# Altium project Capstone_Mainboard.PrjPcb (part 2 of 2)
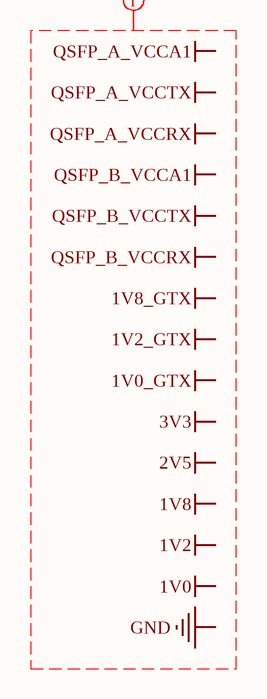
[diagram p11: Misc_Functions.SchDoc]

## Nets that join several sheets
1V2_GTX: FPGA_Power (8 pins), FPGA_GTXqs (R?#5.2)
1V8: HPCC_Connector_A (6 pins), HPCC_Connector_B (6 pins), FPGA_Power (31 pins), FPGA_HPCC_A_BG33-34-35 (R?#3.1)
3V3: FPGA_FLASH (7 pins), I2C_Switch_I2C_EEPROM (23 pins), QSFP_Cages_Connectors (16 pins), HPCC_Connector_A (12 pins), HPCC_Connector_B (12 pins), FPGA_Power (18 pins), FPGA_Configuration_JTAG (5 pins), FPGA_GTXqs (C37.2 U4.1 U4.6)
3V3AUX: HPCC_Connector_A (J3.A11), HPCC_Connector_B (J4.A11)
GND: FPGA_FLASH (A1.4 C1.1), I2C_Switch_I2C_EEPROM (9 pins), QSFP_Cages_Connectors (64 pins), HPCC_Connector_A (209 pins), HPCC_Connector_B (209 pins), FPGA_Power (139 pins), FPGA_Configuration_JTAG (8 pins), FPGA_HPCC_B_BG13-15-16 (6 pins), FPGA_HPCC_A_BG33-34-35 (5 pins), FPGA_GTXqs (C37.1 U4.3)
FGPA_I2C_SCL: I2C_Switch_I2C_EEPROM (R9.1 U1.19), FPGA_Configuration_JTAG (U3.A24)
FGPA_I2C_SDA: I2C_Switch_I2C_EEPROM (R8.1 U1.20), FPGA_Configuration_JTAG (U3.A23)
FPGA_FLASH_~{HOLD}/D3: FPGA_FLASH (R4.1), FPGA_Configuration_JTAG (U3.A22)
FPGA_FLASH_MISO/D1: FPGA_FLASH (R6.1), FPGA_Configuration_JTAG (U3.A25)
FPGA_FLASH_MOSI/D0: FPGA_FLASH (R7.1), FPGA_Configuration_JTAG (U3.B24)
FPGA_FLASH_~{SS}: FPGA_FLASH (A1.1 R1.1), FPGA_Configuration_JTAG (U3.C23)
FPGA_FLASH_SCK: FPGA_FLASH (A1.6), FPGA_Configuration_JTAG (U3.C8)
FPGA_FLASH_~{W}/D2: FPGA_FLASH (R5.1), FPGA_Configuration_JTAG (U3.B22)
HPCC_A_01_N: HPCC_Connector_A (J3.B21), FPGA_HPCC_A_BG33-34-35 (U3.AE11)
HPCC_A_01_P: HPCC_Connector_A (J3.B20), FPGA_HPCC_A_BG33-34-35 (U3.AD11)
HPCC_A_02_N: HPCC_Connector_A (J3.B25), FPGA_HPCC_A_BG33-34-35 (U3.AF9)
HPCC_A_02_P: HPCC_Connector_A (J3.B24), FPGA_HPCC_A_BG33-34-35 (U3.AF10)
HPCC_A_03_N: HPCC_Connector_A (J3.B29), FPGA_HPCC_A_BG33-34-35 (U3.AF7)
HPCC_A_03_P: HPCC_Connector_A (J3.B28), FPGA_HPCC_A_BG33-34-35 (U3.AE7)
HPCC_A_04_N: HPCC_Connector_A (J3.B33), FPGA_HPCC_A_BG33-34-35 (U3.AE5)
HPCC_A_04_P: HPCC_Connector_A (J3.B32), FPGA_HPCC_A_BG33-34-35 (U3.AE6)
HPCC_A_05_N: HPCC_Connector_A (J3.B37), FPGA_HPCC_A_BG33-34-35 (U3.AE2)
HPCC_A_05_P: HPCC_Connector_A (J3.B36), FPGA_HPCC_A_BG33-34-35 (U3.AE3)
HPCC_A_06_N: HPCC_Connector_A (J3.C3), FPGA_HPCC_A_BG33-34-35 (U3.AE20)
HPCC_A_06_P: HPCC_Connector_A (J3.C2), FPGA_HPCC_A_BG33-34-35 (U3.AD20)
HPCC_A_07_N: HPCC_Connector_A (J3.C7), FPGA_HPCC_A_BG33-34-35 (U3.AF18)
HPCC_A_07_P: HPCC_Connector_A (J3.C6), FPGA_HPCC_A_BG33-34-35 (U3.AE18)
HPCC_A_08_N: HPCC_Connector_A (J3.C11), FPGA_HPCC_A_BG33-34-35 (U3.AE16)
HPCC_A_08_P: HPCC_Connector_A (J3.C10), FPGA_HPCC_A_BG33-34-35 (U3.AD16)
HPCC_A_09_N: HPCC_Connector_A (J3.C15), FPGA_HPCC_A_BG33-34-35 (U3.AF15)
HPCC_A_09_P: HPCC_Connector_A (J3.C14), FPGA_HPCC_A_BG33-34-35 (U3.AF14)
HPCC_A_10_N: HPCC_Connector_A (J3.C19), FPGA_HPCC_A_BG33-34-35 (U3.AF12)
HPCC_A_10_P: HPCC_Connector_A (J3.C18), FPGA_HPCC_A_BG33-34-35 (U3.AE12)
HPCC_A_11_N: HPCC_Connector_A (J3.C23), FPGA_HPCC_A_BG33-34-35 (U3.AE10)
HPCC_A_11_P: HPCC_Connector_A (J3.C22), FPGA_HPCC_A_BG33-34-35 (U3.AD10)
HPCC_A_12_N: HPCC_Connector_A (J3.C27), FPGA_HPCC_A_BG33-34-35 (U3.AF8)
HPCC_A_12_P: HPCC_Connector_A (J3.C26), FPGA_HPCC_A_BG33-34-35 (U3.AE8)
HPCC_A_13_N: HPCC_Connector_A (J3.C31), FPGA_HPCC_A_BG33-34-35 (U3.AD5)
HPCC_A_13_P: HPCC_Connector_A (J3.C30), FPGA_HPCC_A_BG33-34-35 (U3.AD6)
HPCC_A_14_N: HPCC_Connector_A (J3.C35), FPGA_HPCC_A_BG33-34-35 (U3.AF4)
HPCC_A_14_P: HPCC_Connector_A (J3.C34), FPGA_HPCC_A_BG33-34-35 (U3.AF5)
HPCC_A_15_N: HPCC_Connector_A (J3.C39), FPGA_HPCC_A_BG33-34-35 (U3.AE1)
HPCC_A_15_P: HPCC_Connector_A (J3.C38), FPGA_HPCC_A_BG33-34-35 (U3.AD1)
HPCC_A_16_N: HPCC_Connector_A (J3.D5), FPGA_HPCC_A_BG33-34-35 (U3.AF20)
HPCC_A_16_P: HPCC_Connector_A (J3.D4), FPGA_HPCC_A_BG33-34-35 (U3.AF19)
HPCC_A_17_N: HPCC_Connector_A (J3.D9), FPGA_HPCC_A_BG33-34-35 (U3.AF17)
HPCC_A_17_P: HPCC_Connector_A (J3.D8), FPGA_HPCC_A_BG33-34-35 (U3.AE17)
HPCC_A_18_N: HPCC_Connector_A (J3.D13), FPGA_HPCC_A_BG33-34-35 (U3.AE15)
HPCC_A_18_P: HPCC_Connector_A (J3.D12), FPGA_HPCC_A_BG33-34-35 (U3.AD15)
HPCC_A_19_N: HPCC_Connector_A (J3.D17), FPGA_HPCC_A_BG33-34-35 (U3.AF13)
HPCC_A_19_P: HPCC_Connector_A (J3.D16), FPGA_HPCC_A_BG33-34-35 (U3.AE13)
HPCC_A_20_N: HPCC_Connector_A (J3.D21), FPGA_HPCC_A_BG33-34-35 (U3.AB10)
HPCC_A_20_P: HPCC_Connector_A (J3.D20), FPGA_HPCC_A_BG33-34-35 (U3.AA10)
HPCC_A_21_N: HPCC_Connector_A (J3.D25), FPGA_HPCC_A_BG33-34-35 (U3.AD8)
HPCC_A_21_P: HPCC_Connector_A (J3.D24), FPGA_HPCC_A_BG33-34-35 (U3.AC8)
HPCC_A_22_N: HPCC_Connector_A (J3.D29), FPGA_HPCC_A_BG33-34-35 (U3.AC6)
HPCC_A_22_P: HPCC_Connector_A (J3.D28), FPGA_HPCC_A_BG33-34-35 (U3.AB6)
HPCC_A_23_N: HPCC_Connector_A (J3.D33), FPGA_HPCC_A_BG33-34-35 (U3.AC3)
HPCC_A_23_P: HPCC_Connector_A (J3.D32), FPGA_HPCC_A_BG33-34-35 (U3.AC4)
HPCC_A_24_N: HPCC_Connector_A (J3.D37), FPGA_HPCC_A_BG33-34-35 (U3.AC2)
HPCC_A_24_P: HPCC_Connector_A (J3.D36), FPGA_HPCC_A_BG33-34-35 (U3.AB2)
HPCC_A_25_N: HPCC_Connector_A (J3.E3), FPGA_HPCC_A_BG33-34-35 (U3.AB20)
HPCC_A_25_P: HPCC_Connector_A (J3.E2), FPGA_HPCC_A_BG33-34-35 (U3.AB19)
HPCC_A_26_N: HPCC_Connector_A (J3.E7), FPGA_HPCC_A_BG33-34-35 (U3.AC17)
HPCC_A_26_P: HPCC_Connector_A (J3.E6), FPGA_HPCC_A_BG33-34-35 (U3.AB17)
HPCC_A_27_N: HPCC_Connector_A (J3.E11), FPGA_HPCC_A_BG33-34-35 (U3.AB15)
HPCC_A_27_P: HPCC_Connector_A (J3.E10), FPGA_HPCC_A_BG33-34-35 (U3.AB14)
HPCC_A_28_N: HPCC_Connector_A (J3.E15), FPGA_HPCC_A_BG33-34-35 (U3.AD13)
HPCC_A_28_P: HPCC_Connector_A (J3.E14), FPGA_HPCC_A_BG33-34-35 (U3.AC13)
HPCC_A_29_N: HPCC_Connector_A (J3.E19), FPGA_HPCC_A_BG33-34-35 (U3.AC11)
HPCC_A_29_P: HPCC_Connector_A (J3.E18), FPGA_HPCC_A_BG33-34-35 (U3.AB11)
HPCC_A_30_N: HPCC_Connector_A (J3.E23), FPGA_HPCC_A_BG33-34-35 (U3.AD9)
HPCC_A_30_P: HPCC_Connector_A (J3.E22), FPGA_HPCC_A_BG33-34-35 (U3.AC9)
HPCC_A_31_N: HPCC_Connector_A (J3.E27), FPGA_HPCC_A_BG33-34-35 (U3.AC7)
HPCC_A_31_P: HPCC_Connector_A (J3.E26), FPGA_HPCC_A_BG33-34-35 (U3.AB7)
HPCC_A_32_N: HPCC_Connector_A (J3.E31), FPGA_HPCC_A_BG33-34-35 (U3.AB5)
HPCC_A_32_P: HPCC_Connector_A (J3.E30), FPGA_HPCC_A_BG33-34-35 (U3.AA5)
HPCC_A_33_N: HPCC_Connector_A (J3.E35), FPGA_HPCC_A_BG33-34-35 (U3.AD3)
HPCC_A_33_P: HPCC_Connector_A (J3.E34), FPGA_HPCC_A_BG33-34-35 (U3.AD4)
HPCC_A_34_N: HPCC_Connector_A (J3.E39), FPGA_HPCC_A_BG33-34-35 (U3.AF2)
HPCC_A_34_P: HPCC_Connector_A (J3.E38), FPGA_HPCC_A_BG33-34-35 (U3.AF3)
HPCC_A_35_N: HPCC_Connector_A (J3.F5), FPGA_HPCC_A_BG33-34-35 (U3.AD18)
HPCC_A_35_P: HPCC_Connector_A (J3.F4), FPGA_HPCC_A_BG33-34-35 (U3.AC18)
HPCC_A_36_N: HPCC_Connector_A (J3.F9), FPGA_HPCC_A_BG33-34-35 (U3.AC16)
HPCC_A_36_P: HPCC_Connector_A (J3.F8), FPGA_HPCC_A_BG33-34-35 (U3.AB16)
HPCC_A_37_N: HPCC_Connector_A (J3.F13), FPGA_HPCC_A_BG33-34-35 (U3.AD14)
HPCC_A_37_P: HPCC_Connector_A (J3.F12), FPGA_HPCC_A_BG33-34-35 (U3.AC14)
HPCC_A_38_N: HPCC_Connector_A (J3.F17), FPGA_HPCC_A_BG33-34-35 (U3.AC12)
HPCC_A_38_P: HPCC_Connector_A (J3.F16), FPGA_HPCC_A_BG33-34-35 (U3.AB12)
HPCC_A_39_N: HPCC_Connector_A (J3.F21), FPGA_HPCC_A_BG33-34-35 (U3.Y12)
HPCC_A_39_P: HPCC_Connector_A (J3.F20), FPGA_HPCC_A_BG33-34-35 (U3.Y13)
HPCC_A_40_N: HPCC_Connector_A (J3.F25), FPGA_HPCC_A_BG33-34-35 (U3.AB9)
HPCC_A_40_P: HPCC_Connector_A (J3.F24), FPGA_HPCC_A_BG33-34-35 (U3.AA9)
HPCC_A_41_N: HPCC_Connector_A (J3.F29), FPGA_HPCC_A_BG33-34-35 (U3.AA7)
HPCC_A_41_P: HPCC_Connector_A (J3.F28), FPGA_HPCC_A_BG33-34-35 (U3.AA8)
HPCC_A_42_N: HPCC_Connector_A (J3.F33), FPGA_HPCC_A_BG33-34-35 (U3.Y5)
HPCC_A_42_P: HPCC_Connector_A (J3.F32), FPGA_HPCC_A_BG33-34-35 (U3.Y6)
HPCC_A_43_N: HPCC_Connector_A (J3.F37), FPGA_HPCC_A_BG33-34-35 (U3.AA2)
HPCC_A_43_P: HPCC_Connector_A (J3.F36), FPGA_HPCC_A_BG33-34-35 (U3.AA3)
HPCC_A_44_N: HPCC_Connector_A (J3.G3), FPGA_HPCC_A_BG33-34-35 (U3.AD19)
HPCC_A_44_P: HPCC_Connector_A (J3.G2), FPGA_HPCC_A_BG33-34-35 (U3.AC19)
HPCC_A_45_N: HPCC_Connector_A (J3.G7), FPGA_HPCC_A_BG33-34-35 (U3.AA20)
HPCC_A_45_P: HPCC_Connector_A (J3.G6), FPGA_HPCC_A_BG33-34-35 (U3.AA19)
HPCC_A_46_N: HPCC_Connector_A (J3.G11), FPGA_HPCC_A_BG33-34-35 (U3.AA18)
HPCC_A_46_P: HPCC_Connector_A (J3.G10), FPGA_HPCC_A_BG33-34-35 (U3.AA17)
HPCC_A_47_N: HPCC_Connector_A (J3.G15), FPGA_HPCC_A_BG33-34-35 (U3.Y16)
HPCC_A_47_P: HPCC_Connector_A (J3.G14), FPGA_HPCC_A_BG33-34-35 (U3.Y15)
HPCC_A_48_N: HPCC_Connector_A (J3.G19), FPGA_HPCC_A_BG33-34-35 (U3.AA12)
HPCC_A_48_P: HPCC_Connector_A (J3.G18), FPGA_HPCC_A_BG33-34-35 (U3.AA13)
HPCC_A_49_N: HPCC_Connector_A (J3.G23), FPGA_HPCC_A_BG33-34-35 (U3.Y10)
HPCC_A_49_P: HPCC_Connector_A (J3.G22), FPGA_HPCC_A_BG33-34-35 (U3.Y11)
HPCC_A_50_N: HPCC_Connector_A (J3.G27), FPGA_HPCC_A_BG33-34-35 (U3.Y7)
HPCC_A_50_P: HPCC_Connector_A (J3.G26), FPGA_HPCC_A_BG33-34-35 (U3.Y8)
HPCC_A_51_N: HPCC_Connector_A (J3.G31), FPGA_HPCC_A_BG33-34-35 (U3.W5)
HPCC_A_51_P: HPCC_Connector_A (J3.G30), FPGA_HPCC_A_BG33-34-35 (U3.W6)
HPCC_A_52_N: HPCC_Connector_A (J3.G35), FPGA_HPCC_A_BG33-34-35 (U3.AB4)
HPCC_A_52_P: HPCC_Connector_A (J3.G34), FPGA_HPCC_A_BG33-34-35 (U3.AA4)
HPCC_A_53_N: HPCC_Connector_A (J3.G39), FPGA_HPCC_A_BG33-34-35 (U3.AC1)
HPCC_A_53_P: HPCC_Connector_A (J3.G38), FPGA_HPCC_A_BG33-34-35 (U3.AB1)
HPCC_A_54_N: HPCC_Connector_A (J3.H5), FPGA_HPCC_A_BG33-34-35 (U3.W19)
HPCC_A_54_P: HPCC_Connector_A (J3.H4), FPGA_HPCC_A_BG33-34-35 (U3.W18)
HPCC_A_55_N: HPCC_Connector_A (J3.H9), FPGA_HPCC_A_BG33-34-35 (U3.Y18)
HPCC_A_55_P: HPCC_Connector_A (J3.H8), FPGA_HPCC_A_BG33-34-35 (U3.Y17)
HPCC_A_56_N: HPCC_Connector_A (J3.H13), FPGA_HPCC_A_BG33-34-35 (U3.V17)
HPCC_A_56_P: HPCC_Connector_A (J3.H12), FPGA_HPCC_A_BG33-34-35 (U3.V16)
HPCC_A_57_N: HPCC_Connector_A (J3.H17), FPGA_HPCC_A_BG33-34-35 (U3.AA15)
HPCC_A_57_P: HPCC_Connector_A (J3.H16), FPGA_HPCC_A_BG33-34-35 (U3.AA14)
HPCC_A_58_N: HPCC_Connector_A (J3.H21), FPGA_HPCC_A_BG33-34-35 (U3.W8)
HPCC_A_58_P: HPCC_Connector_A (J3.H20), FPGA_HPCC_A_BG33-34-35 (U3.V9)
HPCC_A_59_N: HPCC_Connector_A (J3.H25), FPGA_HPCC_A_BG33-34-35 (U3.V6)
HPCC_A_59_P: HPCC_Connector_A (J3.H24), FPGA_HPCC_A_BG33-34-35 (U3.U7)
HPCC_A_60_N: HPCC_Connector_A (J3.H29), FPGA_HPCC_A_BG33-34-35 (U3.W4)
HPCC_A_60_P: HPCC_Connector_A (J3.H28), FPGA_HPCC_A_BG33-34-35 (U3.V4)
HPCC_A_61_N: HPCC_Connector_A (J3.H33), FPGA_HPCC_A_BG33-34-35 (U3.U1)
HPCC_A_61_P: HPCC_Connector_A (J3.H32), FPGA_HPCC_A_BG33-34-35 (U3.U2)
HPCC_A_62_N: HPCC_Connector_A (J3.H37), FPGA_HPCC_A_BG33-34-35 (U3.Y2)
HPCC_A_62_P: HPCC_Connector_A (J3.H36), FPGA_HPCC_A_BG33-34-35 (U3.Y3)
HPCC_A_63_N: HPCC_Connector_A (J3.J3), FPGA_HPCC_A_BG33-34-35 (U3.V19)
HPCC_A_63_P: HPCC_Connector_A (J3.J2), FPGA_HPCC_A_BG33-34-35 (U3.V18)
HPCC_A_64_N: HPCC_Connector_A (J3.J7), FPGA_HPCC_A_BG33-34-35 (U3.W16)
HPCC_A_64_P: HPCC_Connector_A (J3.J6), FPGA_HPCC_A_BG33-34-35 (U3.W15)
HPCC_A_65_N: HPCC_Connector_A (J3.J11), FPGA_HPCC_A_BG33-34-35 (U3.W14)
HPCC_A_65_P: HPCC_Connector_A (J3.J10), FPGA_HPCC_A_BG33-34-35 (U3.V14)
HPCC_A_66_N: HPCC_Connector_A (J3.J15), FPGA_HPCC_A_BG33-34-35 (U3.W11)
HPCC_A_66_P: HPCC_Connector_A (J3.J14), FPGA_HPCC_A_BG33-34-35 (U3.V11)
HPCC_A_67_N: HPCC_Connector_A (J3.J19), FPGA_HPCC_A_BG33-34-35 (U3.W9)
HPCC_A_67_P: HPCC_Connector_A (J3.J18), FPGA_HPCC_A_BG33-34-35 (U3.W10)
HPCC_A_68_N: HPCC_Connector_A (J3.J23), FPGA_HPCC_A_BG33-34-35 (U3.V7)
HPCC_A_68_P: HPCC_Connector_A (J3.J22), FPGA_HPCC_A_BG33-34-35 (U3.V8)
HPCC_A_69_N: HPCC_Connector_A (J3.J27), FPGA_HPCC_A_BG33-34-35 (U3.U5)
HPCC_A_69_P: HPCC_Connector_A (J3.J26), FPGA_HPCC_A_BG33-34-35 (U3.U6)
HPCC_A_70_N: HPCC_Connector_A (J3.J31), FPGA_HPCC_A_BG33-34-35 (U3.W3)
HPCC_A_70_P: HPCC_Connector_A (J3.J30), FPGA_HPCC_A_BG33-34-35 (U3.V3)
HPCC_A_71_N: HPCC_Connector_A (J3.J35), FPGA_HPCC_A_BG33-34-35 (U3.V1)
HPCC_A_71_P: HPCC_Connector_A (J3.J34), FPGA_HPCC_A_BG33-34-35 (U3.V2)
HPCC_A_72_N: HPCC_Connector_A (J3.J39), FPGA_HPCC_A_BG33-34-35 (U3.Y1)
HPCC_A_72_P: HPCC_Connector_A (J3.J38), FPGA_HPCC_A_BG33-34-35 (U3.W1)
HPCC_A_GP01: HPCC_Connector_A (J3.A18), FPGA_Configuration_JTAG (U3.AE23)
HPCC_A_GP02: HPCC_Connector_A (J3.A19), FPGA_Configuration_JTAG (U3.AF23)
HPCC_A_GP03: HPCC_Connector_A (J3.A22), FPGA_Configuration_JTAG (U3.AC23)
HPCC_A_GP04: HPCC_Connector_A (J3.A23), FPGA_Configuration_JTAG (U3.AC22)
HPCC_A_GP05: HPCC_Connector_A (J3.A26), FPGA_Configuration_JTAG (U3.AE21)
HPCC_A_GP06: HPCC_Connector_A (J3.A27), FPGA_Configuration_JTAG (U3.AD21)
HPCC_A_GP07: HPCC_Connector_A (J3.A30), FPGA_Configuration_JTAG (U3.AC21)
HPCC_A_GP08: HPCC_Connector_A (J3.A31), FPGA_Configuration_JTAG (U3.AB21)
HPCC_A_GP09: HPCC_Connector_A (J3.A34), FPGA_Configuration_JTAG (U3.AB22)
HPCC_A_GP10: HPCC_Connector_A (J3.A35), FPGA_Configuration_JTAG (U3.AA22)
HPCC_A_GP11: HPCC_Connector_A (J3.A38), FPGA_Configuration_JTAG (U3.Y21)
HPCC_A_GP12: HPCC_Connector_A (J3.A39), FPGA_Configuration_JTAG (U3.W20)
HPCC_A_GP13: HPCC_Connector_A (J3.B4), FPGA_Configuration_JTAG (U3.Y22)
HPCC_A_GP14: HPCC_Connector_A (J3.B5), FPGA_Configuration_JTAG (U3.AD26)
HPCC_A_GP15: HPCC_Connector_A (J3.B8), FPGA_Configuration_JTAG (U3.AC24)
HPCC_A_GP16: HPCC_Connector_A (J3.B9), FPGA_Configuration_JTAG (U3.AE26)
HPCC_A_GP17: HPCC_Connector_A (J3.B12), FPGA_Configuration_JTAG (U3.AD24)
HPCC_A_GP18: HPCC_Connector_A (J3.B13), FPGA_Configuration_JTAG (U3.AF25)
HPCC_A_GP19: HPCC_Connector_A (J3.B16), FPGA_Configuration_JTAG (U3.AD23)
HPCC_A_GP20: HPCC_Connector_A (J3.B17), FPGA_Configuration_JTAG (U3.AF24)
HPCC_A_I2C_SCL: I2C_Switch_I2C_EEPROM (R12.1 U1.2), HPCC_Connector_A (J3.A14)
HPCC_A_I2C_SDA: I2C_Switch_I2C_EEPROM (R11.1 U1.1), HPCC_Connector_A (J3.A15)
HPCC_B_01_N: HPCC_Connector_B (J4.B21), FPGA_HPCC_B_BG13-15-16 (U3.A19)
HPCC_B_01_P: HPCC_Connector_B (J4.B20), FPGA_HPCC_B_BG13-15-16 (U3.A18)
HPCC_B_02_N: HPCC_Connector_B (J4.B25), FPGA_HPCC_B_BG13-15-16 (U3.D20)
HPCC_B_02_P: HPCC_Connector_B (J4.B24), FPGA_HPCC_B_BG13-15-16 (U3.D19)
HPCC_B_03_N: HPCC_Connector_B (J4.B29), FPGA_HPCC_B_BG13-15-16 (U3.K26)
HPCC_B_03_P: HPCC_Connector_B (J4.B28), FPGA_HPCC_B_BG13-15-16 (U3.K25)
HPCC_B_04_N: HPCC_Connector_B (J4.B33), FPGA_HPCC_B_BG13-15-16 (U3.L25)
HPCC_B_04_P: HPCC_Connector_B (J4.B32), FPGA_HPCC_B_BG13-15-16 (U3.M25)
HPCC_B_05_N: HPCC_Connector_B (J4.B37), FPGA_HPCC_B_BG13-15-16 (U3.P25)
HPCC_B_05_P: HPCC_Connector_B (J4.B36), FPGA_HPCC_B_BG13-15-16 (U3.R25)
HPCC_B_06_N: HPCC_Connector_B (J4.C3), FPGA_HPCC_B_BG13-15-16 (U3.B9)
HPCC_B_06_P: HPCC_Connector_B (J4.C2), FPGA_HPCC_B_BG13-15-16 (U3.C9)
HPCC_B_07_N: HPCC_Connector_B (J4.C7), FPGA_HPCC_B_BG13-15-16 (U3.B11)
HPCC_B_07_P: HPCC_Connector_B (J4.C6), FPGA_HPCC_B_BG13-15-16 (U3.B12)
HPCC_B_08_N: HPCC_Connector_B (J4.C11), FPGA_HPCC_B_BG13-15-16 (U3.C13)
HPCC_B_08_P: HPCC_Connector_B (J4.C10), FPGA_HPCC_B_BG13-15-16 (U3.C14)
HPCC_B_09_N: HPCC_Connector_B (J4.C15), FPGA_HPCC_B_BG13-15-16 (U3.A15)
HPCC_B_09_P: HPCC_Connector_B (J4.C14), FPGA_HPCC_B_BG13-15-16 (U3.B15)
HPCC_B_10_N: HPCC_Connector_B (J4.C19), FPGA_HPCC_B_BG13-15-16 (U3.A17)
HPCC_B_10_P: HPCC_Connector_B (J4.C18), FPGA_HPCC_B_BG13-15-16 (U3.B17)
HPCC_B_11_N: HPCC_Connector_B (J4.C23), FPGA_HPCC_B_BG13-15-16 (U3.B19)
HPCC_B_11_P: HPCC_Connector_B (J4.C22), FPGA_HPCC_B_BG13-15-16 (U3.C19)
HPCC_B_12_N: HPCC_Connector_B (J4.C27), FPGA_HPCC_B_BG13-15-16 (U3.E20)
HPCC_B_12_P: HPCC_Connector_B (J4.C26), FPGA_HPCC_B_BG13-15-16 (U3.F19)
HPCC_B_13_N: HPCC_Connector_B (J4.C31), FPGA_HPCC_B_BG13-15-16 (U3.L24)
HPCC_B_13_P: HPCC_Connector_B (J4.C30), FPGA_HPCC_B_BG13-15-16 (U3.M24)
HPCC_B_14_N: HPCC_Connector_B (J4.C35), FPGA_HPCC_B_BG13-15-16 (U3.M26)
HPCC_B_14_P: HPCC_Connector_B (J4.C34), FPGA_HPCC_B_BG13-15-16 (U3.N26)
HPCC_B_15_N: HPCC_Connector_B (J4.C39), FPGA_HPCC_B_BG13-15-16 (U3.T25)
HPCC_B_15_P: HPCC_Connector_B (J4.C38), FPGA_HPCC_B_BG13-15-16 (U3.T24)
HPCC_B_16_N: HPCC_Connector_B (J4.D5), FPGA_HPCC_B_BG13-15-16 (U3.A10)
HPCC_B_16_P: HPCC_Connector_B (J4.D4), FPGA_HPCC_B_BG13-15-16 (U3.B10)
HPCC_B_17_N: HPCC_Connector_B (J4.D9), FPGA_HPCC_B_BG13-15-16 (U3.A12)
HPCC_B_17_P: HPCC_Connector_B (J4.D8), FPGA_HPCC_B_BG13-15-16 (U3.A13)
HPCC_B_18_N: HPCC_Connector_B (J4.D13), FPGA_HPCC_B_BG13-15-16 (U3.A14)
HPCC_B_18_P: HPCC_Connector_B (J4.D12), FPGA_HPCC_B_BG13-15-16 (U3.B14)
HPCC_B_19_N: HPCC_Connector_B (J4.D17), FPGA_HPCC_B_BG13-15-16 (U3.B16)
HPCC_B_19_P: HPCC_Connector_B (J4.D16), FPGA_HPCC_B_BG13-15-16 (U3.C16)
HPCC_B_20_N: HPCC_Connector_B (J4.D21), FPGA_HPCC_B_BG13-15-16 (U3.D18)
HPCC_B_20_P: HPCC_Connector_B (J4.D20), FPGA_HPCC_B_BG13-15-16 (U3.E18)
HPCC_B_21_N: HPCC_Connector_B (J4.D25), FPGA_HPCC_B_BG13-15-16 (U3.J19)
HPCC_B_21_P: HPCC_Connector_B (J4.D24), FPGA_HPCC_B_BG13-15-16 (U3.J18)
HPCC_B_22_N: HPCC_Connector_B (J4.D29), FPGA_HPCC_B_BG13-15-16 (U3.L20)
HPCC_B_22_P: HPCC_Connector_B (J4.D28), FPGA_HPCC_B_BG13-15-16 (U3.L19)
HPCC_B_23_N: HPCC_Connector_B (J4.D33), FPGA_HPCC_B_BG13-15-16 (U3.N23)
HPCC_B_23_P: HPCC_Connector_B (J4.D32), FPGA_HPCC_B_BG13-15-16 (U3.P23)
HPCC_B_24_N: HPCC_Connector_B (J4.D37), FPGA_HPCC_B_BG13-15-16 (U3.R23)
HPCC_B_24_P: HPCC_Connector_B (J4.D36), FPGA_HPCC_B_BG13-15-16 (U3.R22)
HPCC_B_25_N: HPCC_Connector_B (J4.E3), FPGA_HPCC_B_BG13-15-16 (U3.D8)
HPCC_B_25_P: HPCC_Connector_B (J4.E2), FPGA_HPCC_B_BG13-15-16 (U3.D9)
HPCC_B_26_N: HPCC_Connector_B (J4.E7), FPGA_HPCC_B_BG13-15-16 (U3.C11)
HPCC_B_26_P: HPCC_Connector_B (J4.E6), FPGA_HPCC_B_BG13-15-16 (U3.C12)
HPCC_B_27_N: HPCC_Connector_B (J4.E11), FPGA_HPCC_B_BG13-15-16 (U3.D13)
HPCC_B_27_P: HPCC_Connector_B (J4.E10), FPGA_HPCC_B_BG13-15-16 (U3.D14)
HPCC_B_28_N: HPCC_Connector_B (J4.E15), FPGA_HPCC_B_BG13-15-16 (U3.D16)
HPCC_B_28_P: HPCC_Connector_B (J4.E14), FPGA_HPCC_B_BG13-15-16 (U3.D15)
HPCC_B_29_N: HPCC_Connector_B (J4.E19), FPGA_HPCC_B_BG13-15-16 (U3.C18)
HPCC_B_29_P: HPCC_Connector_B (J4.E18), FPGA_HPCC_B_BG13-15-16 (U3.C17)
HPCC_B_30_N: HPCC_Connector_B (J4.E23), FPGA_HPCC_B_BG13-15-16 (U3.G20)
HPCC_B_30_P: HPCC_Connector_B (J4.E22), FPGA_HPCC_B_BG13-15-16 (U3.H19)
HPCC_B_31_N: HPCC_Connector_B (J4.E27), FPGA_HPCC_B_BG13-15-16 (U3.J20)
HPCC_B_31_P: HPCC_Connector_B (J4.E26), FPGA_HPCC_B_BG13-15-16 (U3.K20)
HPCC_B_32_N: HPCC_Connector_B (J4.E31), FPGA_HPCC_B_BG13-15-16 (U3.M22)
HPCC_B_32_P: HPCC_Connector_B (J4.E30), FPGA_HPCC_B_BG13-15-16 (U3.M21)
HPCC_B_33_N: HPCC_Connector_B (J4.E35), FPGA_HPCC_B_BG13-15-16 (U3.N24)
HPCC_B_33_P: HPCC_Connector_B (J4.E34), FPGA_HPCC_B_BG13-15-16 (U3.P24)
HPCC_B_34_N: HPCC_Connector_B (J4.E39), FPGA_HPCC_B_BG13-15-16 (U3.P26)
HPCC_B_34_P: HPCC_Connector_B (J4.E38), FPGA_HPCC_B_BG13-15-16 (U3.R26)
HPCC_B_35_N: HPCC_Connector_B (J4.F5), FPGA_HPCC_B_BG13-15-16 (U3.D11)
HPCC_B_35_P: HPCC_Connector_B (J4.F4), FPGA_HPCC_B_BG13-15-16 (U3.E11)
HPCC_B_36_N: HPCC_Connector_B (J4.F9), FPGA_HPCC_B_BG13-15-16 (U3.E12)
HPCC_B_36_P: HPCC_Connector_B (J4.F8), FPGA_HPCC_B_BG13-15-16 (U3.E13)
HPCC_B_37_N: HPCC_Connector_B (J4.F13), FPGA_HPCC_B_BG13-15-16 (U3.E16)
HPCC_B_37_P: HPCC_Connector_B (J4.F12), FPGA_HPCC_B_BG13-15-16 (U3.E15)
HPCC_B_38_N: HPCC_Connector_B (J4.F17), FPGA_HPCC_B_BG13-15-16 (U3.E17)
HPCC_B_38_P: HPCC_Connector_B (J4.F16), FPGA_HPCC_B_BG13-15-16 (U3.F17)
HPCC_B_39_N: HPCC_Connector_B (J4.F21), FPGA_HPCC_B_BG13-15-16 (U3.F18)
HPCC_B_39_P: HPCC_Connector_B (J4.F20), FPGA_HPCC_B_BG13-15-16 (U3.G17)
HPCC_B_40_N: HPCC_Connector_B (J4.F25), FPGA_HPCC_B_BG13-15-16 (U3.K17)
HPCC_B_40_P: HPCC_Connector_B (J4.F24), FPGA_HPCC_B_BG13-15-16 (U3.K16)
HPCC_B_41_N: HPCC_Connector_B (J4.F29), FPGA_HPCC_B_BG13-15-16 (U3.L18)
HPCC_B_41_P: HPCC_Connector_B (J4.F28), FPGA_HPCC_B_BG13-15-16 (U3.M17)
HPCC_B_42_N: HPCC_Connector_B (J4.F33), FPGA_HPCC_B_BG13-15-16 (U3.N22)
HPCC_B_42_P: HPCC_Connector_B (J4.F32), FPGA_HPCC_B_BG13-15-16 (U3.N21)
HPCC_B_43_N: HPCC_Connector_B (J4.F37), FPGA_HPCC_B_BG13-15-16 (U3.T19)
HPCC_B_43_P: HPCC_Connector_B (J4.F36), FPGA_HPCC_B_BG13-15-16 (U3.T18)
HPCC_B_44_N: HPCC_Connector_B (J4.G3), FPGA_HPCC_B_BG13-15-16 (U3.F8)
HPCC_B_44_P: HPCC_Connector_B (J4.G2), FPGA_HPCC_B_BG13-15-16 (U3.F9)
HPCC_B_45_N: HPCC_Connector_B (J4.G7), FPGA_HPCC_B_BG13-15-16 (U3.D10)
HPCC_B_45_P: HPCC_Connector_B (J4.G6), FPGA_HPCC_B_BG13-15-16 (U3.E10)
HPCC_B_46_N: HPCC_Connector_B (J4.G11), FPGA_HPCC_B_BG13-15-16 (U3.F12)
HPCC_B_46_P: HPCC_Connector_B (J4.G10), FPGA_HPCC_B_BG13-15-16 (U3.G12)
HPCC_B_47_N: HPCC_Connector_B (J4.G15), FPGA_HPCC_B_BG13-15-16 (U3.G14)
HPCC_B_47_P: HPCC_Connector_B (J4.G14), FPGA_HPCC_B_BG13-15-16 (U3.H14)
HPCC_B_48_N: HPCC_Connector_B (J4.G19), FPGA_HPCC_B_BG13-15-16 (U3.G16)
HPCC_B_48_P: HPCC_Connector_B (J4.G18), FPGA_HPCC_B_BG13-15-16 (U3.H16)
HPCC_B_49_N: HPCC_Connector_B (J4.G23), FPGA_HPCC_B_BG13-15-16 (U3.H18)
HPCC_B_49_P: HPCC_Connector_B (J4.G22), FPGA_HPCC_B_BG13-15-16 (U3.H17)
HPCC_B_50_N: HPCC_Connector_B (J4.G27), FPGA_HPCC_B_BG13-15-16 (U3.K18)
HPCC_B_50_P: HPCC_Connector_B (J4.G26), FPGA_HPCC_B_BG13-15-16 (U3.L17)
HPCC_B_51_N: HPCC_Connector_B (J4.G31), FPGA_HPCC_B_BG13-15-16 (U3.M20)
HPCC_B_51_P: HPCC_Connector_B (J4.G30), FPGA_HPCC_B_BG13-15-16 (U3.N19)
HPCC_B_52_N: HPCC_Connector_B (J4.G35), FPGA_HPCC_B_BG13-15-16 (U3.P20)
HPCC_B_52_P: HPCC_Connector_B (J4.G34), FPGA_HPCC_B_BG13-15-16 (U3.P19)
HPCC_B_53_N: HPCC_Connector_B (J4.G39), FPGA_HPCC_B_BG13-15-16 (U3.U20)
HPCC_B_53_P: HPCC_Connector_B (J4.G38), FPGA_HPCC_B_BG13-15-16 (U3.U19)
HPCC_B_54_N: HPCC_Connector_B (J4.H5), FPGA_HPCC_B_BG13-15-16 (U3.G9)
HPCC_B_54_P: HPCC_Connector_B (J4.H4), FPGA_HPCC_B_BG13-15-16 (U3.G10)
HPCC_B_55_N: HPCC_Connector_B (J4.H9), FPGA_HPCC_B_BG13-15-16 (U3.F10)
HPCC_B_55_P: HPCC_Connector_B (J4.H8), FPGA_HPCC_B_BG13-15-16 (U3.G11)
HPCC_B_56_N: HPCC_Connector_B (J4.H13), FPGA_HPCC_B_BG13-15-16 (U3.F13)
HPCC_B_56_P: HPCC_Connector_B (J4.H12), FPGA_HPCC_B_BG13-15-16 (U3.F14)
HPCC_B_57_N: HPCC_Connector_B (J4.H17), FPGA_HPCC_B_BG13-15-16 (U3.F15)
HPCC_B_57_P: HPCC_Connector_B (J4.H16), FPGA_HPCC_B_BG13-15-16 (U3.G15)
HPCC_B_58_N: HPCC_Connector_B (J4.H21), FPGA_HPCC_B_BG13-15-16 (U3.J16)
HPCC_B_58_P: HPCC_Connector_B (J4.H20), FPGA_HPCC_B_BG13-15-16 (U3.J15)
HPCC_B_59_N: HPCC_Connector_B (J4.H25), FPGA_HPCC_B_BG13-15-16 (U3.N17)
HPCC_B_59_P: HPCC_Connector_B (J4.H24), FPGA_HPCC_B_BG13-15-16 (U3.P16)
HPCC_B_60_N: HPCC_Connector_B (J4.H29), FPGA_HPCC_B_BG13-15-16 (U3.P18)
HPCC_B_60_P: HPCC_Connector_B (J4.H28), FPGA_HPCC_B_BG13-15-16 (U3.R18)
HPCC_B_61_N: HPCC_Connector_B (J4.H33), FPGA_HPCC_B_BG13-15-16 (U3.R17)
HPCC_B_61_P: HPCC_Connector_B (J4.H32), FPGA_HPCC_B_BG13-15-16 (U3.R16)
HPCC_B_62_N: HPCC_Connector_B (J4.H37), FPGA_HPCC_B_BG13-15-16 (U3.R20)
HPCC_B_62_P: HPCC_Connector_B (J4.H36), FPGA_HPCC_B_BG13-15-16 (U3.T20)
HPCC_B_63_N: HPCC_Connector_B (J4.J3), FPGA_HPCC_B_BG13-15-16 (U3.A8)
HPCC_B_63_P: HPCC_Connector_B (J4.J2), FPGA_HPCC_B_BG13-15-16 (U3.A9)
HPCC_B_64_N: HPCC_Connector_B (J4.J7), FPGA_HPCC_B_BG13-15-16 (U3.H8)
HPCC_B_64_P: HPCC_Connector_B (J4.J6), FPGA_HPCC_B_BG13-15-16 (U3.H9)
HPCC_B_65_N: HPCC_Connector_B (J4.J11), FPGA_HPCC_B_BG13-15-16 (U3.J10)
HPCC_B_65_P: HPCC_Connector_B (J4.J10), FPGA_HPCC_B_BG13-15-16 (U3.J11)
HPCC_B_66_N: HPCC_Connector_B (J4.J15), FPGA_HPCC_B_BG13-15-16 (U3.H11)
HPCC_B_66_P: HPCC_Connector_B (J4.J14), FPGA_HPCC_B_BG13-15-16 (U3.H12)
HPCC_B_67_N: HPCC_Connector_B (J4.J19), FPGA_HPCC_B_BG13-15-16 (U3.H13)
HPCC_B_67_P: HPCC_Connector_B (J4.J18), FPGA_HPCC_B_BG13-15-16 (U3.J13)
HPCC_B_68_N: HPCC_Connector_B (J4.J23), FPGA_HPCC_B_BG13-15-16 (U3.F20)
HPCC_B_68_P: HPCC_Connector_B (J4.J22), FPGA_HPCC_B_BG13-15-16 (U3.G19)
HPCC_B_69_N: HPCC_Connector_B (J4.J27), FPGA_HPCC_B_BG13-15-16 (U3.M19)
HPCC_B_69_P: HPCC_Connector_B (J4.J26), FPGA_HPCC_B_BG13-15-16 (U3.N18)
HPCC_B_70_N: HPCC_Connector_B (J4.J31), FPGA_HPCC_B_BG13-15-16 (U3.P21)
HPCC_B_70_P: HPCC_Connector_B (J4.J30), FPGA_HPCC_B_BG13-15-16 (U3.R21)
HPCC_B_71_N: HPCC_Connector_B (J4.J35), FPGA_HPCC_B_BG13-15-16 (U3.T17)
HPCC_B_71_P: HPCC_Connector_B (J4.J34), FPGA_HPCC_B_BG13-15-16 (U3.U17)
HPCC_B_72_N: HPCC_Connector_B (J4.J39), FPGA_HPCC_B_BG13-15-16 (U3.T23)
HPCC_B_72_P: HPCC_Connector_B (J4.J38), FPGA_HPCC_B_BG13-15-16 (U3.T22)
HPCC_B_GP01: HPCC_Connector_B (J4.A18), FPGA_Configuration_JTAG (U3.W26)
HPCC_B_GP02: HPCC_Connector_B (J4.A19), FPGA_Configuration_JTAG (U3.Y25)
HPCC_B_GP03: HPCC_Connector_B (J4.A22), FPGA_Configuration_JTAG (U3.AA25)
HPCC_B_GP04: HPCC_Connector_B (J4.A23), FPGA_Configuration_JTAG (U3.AB25)
HPCC_B_GP05: HPCC_Connector_B (J4.A26), FPGA_Configuration_JTAG (U3.AB26)
HPCC_B_GP06: HPCC_Connector_B (J4.A27), FPGA_Configuration_JTAG (U3.AC26)
HPCC_B_GP07: HPCC_Connector_B (J4.A30), FPGA_Configuration_JTAG (U3.V23)
HPCC_B_GP08: HPCC_Connector_B (J4.A31), FPGA_Configuration_JTAG (U3.U22)
HPCC_B_GP09: HPCC_Connector_B (J4.A34), FPGA_Configuration_JTAG (U3.W23)
HPCC_B_GP10: HPCC_Connector_B (J4.A35), FPGA_Configuration_JTAG (U3.V22)
HPCC_B_GP11: HPCC_Connector_B (J4.A38), FPGA_Configuration_JTAG (U3.V21)
HPCC_B_GP12: HPCC_Connector_B (J4.A39), FPGA_Configuration_JTAG (U3.W21)
HPCC_B_GP13: HPCC_Connector_B (J4.B4), FPGA_Configuration_JTAG (U3.U21)
HPCC_B_GP14: HPCC_Connector_B (J4.B5), FPGA_Configuration_JTAG (U3.U24)
HPCC_B_GP15: HPCC_Connector_B (J4.B8), FPGA_Configuration_JTAG (U3.V24)
HPCC_B_GP16: HPCC_Connector_B (J4.B9), FPGA_Configuration_JTAG (U3.U25)
HPCC_B_GP17: HPCC_Connector_B (J4.B12), FPGA_Configuration_JTAG (U3.U26)
HPCC_B_GP18: HPCC_Connector_B (J4.B13), FPGA_Configuration_JTAG (U3.W24)
HPCC_B_GP19: HPCC_Connector_B (J4.B16), FPGA_Configuration_JTAG (U3.V26)
HPCC_B_GP20: HPCC_Connector_B (J4.B17), FPGA_Configuration_JTAG (U3.W25)
HPCC_B_I2C_SCL: I2C_Switch_I2C_EEPROM (R14.1 U1.4), HPCC_Connector_B (J4.A14)
HPCC_B_I2C_SDA: I2C_Switch_I2C_EEPROM (R13.1 U1.3), HPCC_Connector_B (J4.A15)
JTAG_TCK: HPCC_Connector_A (J3.A3), HPCC_Connector_B (J4.A3), FPGA_Configuration_JTAG (U3.L8)
JTAG_TDI: HPCC_Connector_A (J3.A7), HPCC_Connector_B (J4.A7), FPGA_Configuration_JTAG (U3.R6)
JTAG_TDO: HPCC_Connector_A (J3.A6), HPCC_Connector_B (J4.A6), FPGA_Configuration_JTAG (U3.R7)
JTAG_TMS: HPCC_Connector_A (J3.A2), HPCC_Connector_B (J4.A2), FPGA_Configuration_JTAG (U3.N8)
JTAG_TRST: HPCC_Connector_A (J3.A10), HPCC_Connector_B (J4.A10)
PWR_FAIL: HPCC_Connector_A (J3.B1), HPCC_Connector_B (J4.B1), FPGA_Configuration_JTAG (U3.K21)
QSFP_A_IntL/~{RxLos}: QSFP_Cages_Connectors (J1.28 R31.1), FPGA_Configuration_JTAG (U3.K22)
QSFP_A_LPMode/TxDis: QSFP_Cages_Connectors (J1.31), FPGA_Configuration_JTAG (U3.L23)
QSFP_A_~{ModPrs}: QSFP_Cages_Connectors (J1.27 R29.1), FPGA_Configuration_JTAG (U3.L22)
QSFP_A_~{ModSel}: QSFP_Cages_Connectors (J1.8), FPGA_Configuration_JTAG (U3.J23)
QSFP_A_~{Reset}: QSFP_Cages_Connectors (J1.9 R27.1), FPGA_Configuration_JTAG (U3.K23)
QSFP_A_RX1_N: QSFP_Cages_Connectors (J1.18), FPGA_GTXqs (U3.R3)
QSFP_A_RX1_P: QSFP_Cages_Connectors (J1.17), FPGA_GTXqs (U3.R4)
QSFP_A_RX2_N: QSFP_Cages_Connectors (J1.21), FPGA_GTXqs (U3.N3)
QSFP_A_RX2_P: QSFP_Cages_Connectors (J1.22), FPGA_GTXqs (U3.N4)
QSFP_A_RX3_N: QSFP_Cages_Connectors (J1.15), FPGA_GTXqs (U3.L3)
QSFP_A_RX3_P: QSFP_Cages_Connectors (J1.14), FPGA_GTXqs (U3.L4)
QSFP_A_RX4_N: QSFP_Cages_Connectors (J1.24), FPGA_GTXqs (U3.J3)
QSFP_A_RX4_P: QSFP_Cages_Connectors (J1.25), FPGA_GTXqs (U3.J4)
QSFP_A_SCL: I2C_Switch_I2C_EEPROM (R16.1 U1.6), QSFP_Cages_Connectors (J1.11)
QSFP_A_SDA: I2C_Switch_I2C_EEPROM (R15.1 U1.5), QSFP_Cages_Connectors (J1.12)
QSFP_A_TX1_N: QSFP_Cages_Connectors (J1.37), FPGA_GTXqs (U3.P2)
QSFP_A_TX1_P: QSFP_Cages_Connectors (J1.36), FPGA_GTXqs (U3.P1)
QSFP_A_TX2_N: QSFP_Cages_Connectors (J1.2), FPGA_GTXqs (U3.M2)
QSFP_A_TX2_P: QSFP_Cages_Connectors (J1.3), FPGA_GTXqs (U3.M1)
QSFP_A_TX3_N: QSFP_Cages_Connectors (J1.34), FPGA_GTXqs (U3.K2)
QSFP_A_TX3_P: QSFP_Cages_Connectors (J1.33), FPGA_GTXqs (U3.K1)
QSFP_A_TX4_N: QSFP_Cages_Connectors (J1.5), FPGA_GTXqs (U3.H2)
QSFP_A_TX4_P: QSFP_Cages_Connectors (J1.6), FPGA_GTXqs (U3.H1)
QSFP_B_IntL/~{RxLos}: QSFP_Cages_Connectors (J2.28 R32.1), FPGA_Configuration_JTAG (U3.J21)
QSFP_B_LPMode/TxDis: QSFP_Cages_Connectors (J2.31), FPGA_Configuration_JTAG (U3.J25)
QSFP_B_~{ModPrs}: QSFP_Cages_Connectors (J2.27 R30.1), FPGA_Configuration_JTAG (U3.H24)
QSFP_B_~{ModSel}: QSFP_Cages_Connectors (J2.8), FPGA_Configuration_JTAG (U3.J24)
QSFP_B_~{Reset}: QSFP_Cages_Connectors (J2.9 R28.1), FPGA_Configuration_JTAG (U3.H22)
QSFP_B_RX1_N: QSFP_Cages_Connectors (J2.18), FPGA_GTXqs (U3.G3)
QSFP_B_RX1_P: QSFP_Cages_Connectors (J2.17), FPGA_GTXqs (U3.G4)
QSFP_B_RX2_N: QSFP_Cages_Connectors (J2.21), FPGA_GTXqs (U3.E3)
QSFP_B_RX2_P: QSFP_Cages_Connectors (J2.22), FPGA_GTXqs (U3.E4)
QSFP_B_RX3_N: QSFP_Cages_Connectors (J2.15), FPGA_GTXqs (U3.C3)
QSFP_B_RX3_P: QSFP_Cages_Connectors (J2.14), FPGA_GTXqs (U3.C4)
QSFP_B_RX4_N: QSFP_Cages_Connectors (J2.24), FPGA_GTXqs (U3.B5)
QSFP_B_RX4_P: QSFP_Cages_Connectors (J2.25), FPGA_GTXqs (U3.B6)
QSFP_B_SCL: I2C_Switch_I2C_EEPROM (R18.1 U1.8), QSFP_Cages_Connectors (J2.11)
QSFP_B_SDA: I2C_Switch_I2C_EEPROM (R17.1 U1.7), QSFP_Cages_Connectors (J2.12)
QSFP_B_TX1_N: QSFP_Cages_Connectors (J2.37), FPGA_GTXqs (U3.F2)
QSFP_B_TX1_P: QSFP_Cages_Connectors (J2.36), FPGA_GTXqs (U3.F1)
QSFP_B_TX2_N: QSFP_Cages_Connectors (J2.2), FPGA_GTXqs (U3.D2)
QSFP_B_TX2_P: QSFP_Cages_Connectors (J2.3), FPGA_GTXqs (U3.D1)
QSFP_B_TX3_N: QSFP_Cages_Connectors (J2.34), FPGA_GTXqs (U3.B2)
QSFP_B_TX3_P: QSFP_Cages_Connectors (J2.33), FPGA_GTXqs (U3.B1)
QSFP_B_TX4_N: QSFP_Cages_Connectors (J2.5), FPGA_GTXqs (U3.A4)
QSFP_B_TX4_P: QSFP_Cages_Connectors (J2.6), FPGA_GTXqs (U3.A3)